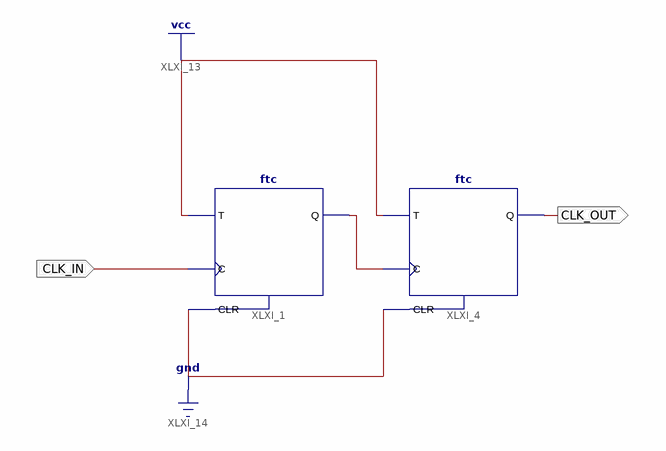
[diagram p0: schematic sheet 1]
// Xilinx ISE schematic DIV_4.sch (spartan6) as structural Verilog: 2 symbols, 2 ports
module DIV_4 (
  input  CLK_IN,
  output CLK_OUT
);

  wire XLXN_1;

  ftc XLXI_1 (.C(CLK_IN), .CLR(1'b0), .T(1'b1), .Q(XLXN_1));
  ftc XLXI_4 (.C(XLXN_1), .CLR(1'b0), .T(1'b1), .Q(CLK_OUT));
endmodule
